# Altium schematic sheet Power_Circuit.SchDoc
size A; SheetNumber: 1; SheetTotal: 5
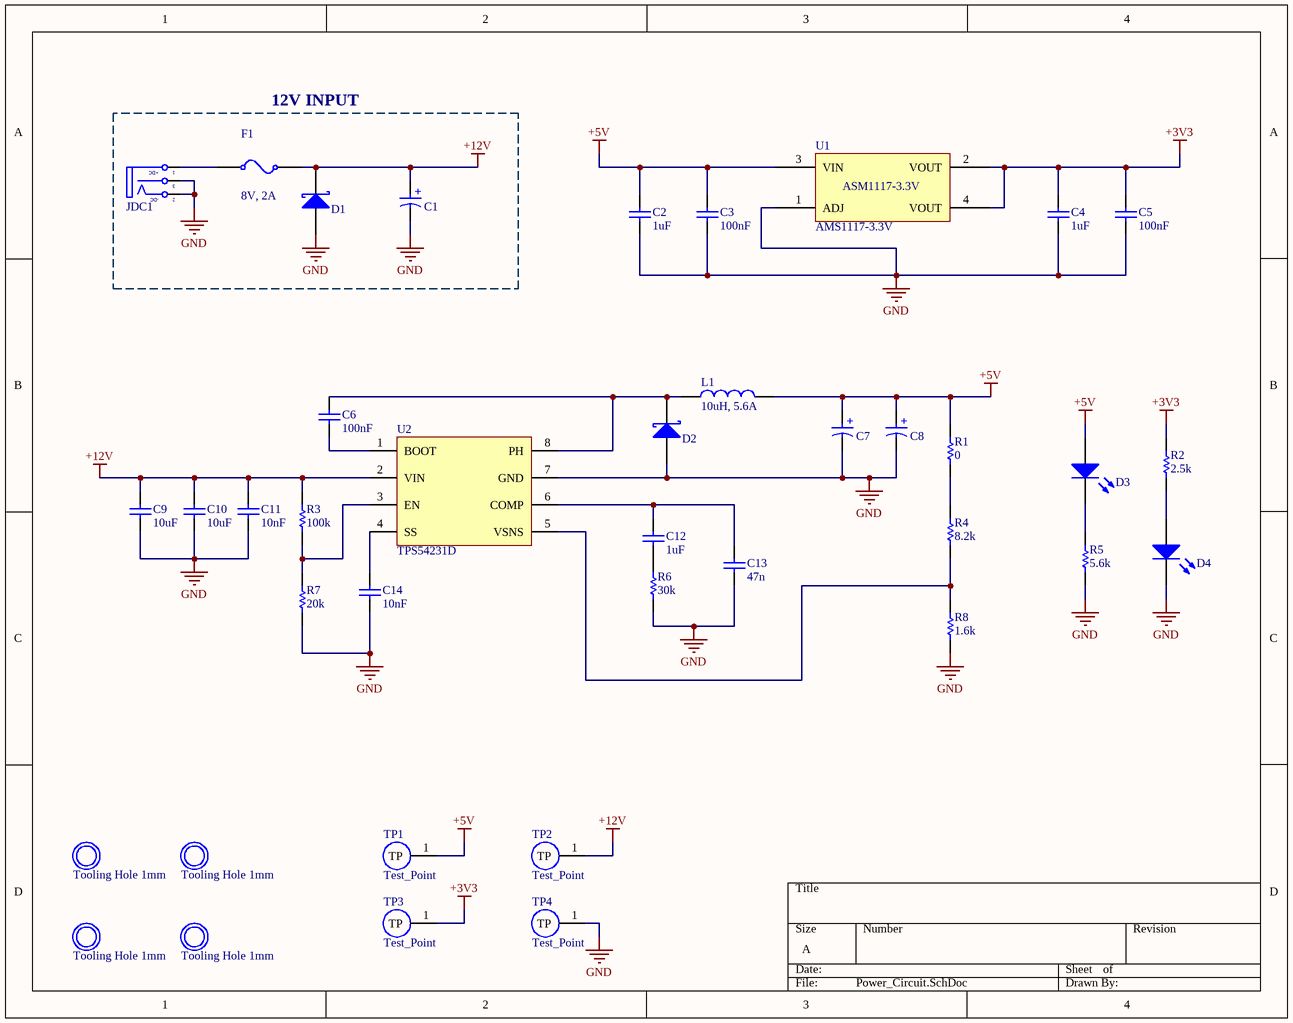
[diagram p0: Power_Circuit.SchDoc]

## Parts
C1  47uF  [WCAP-ASLI_D4H5.5]  (value not drawn)
C2  1uF  [CAP_0603]
C3  100nF  [CAP_0603]
C4  1uF  [CAP_0603]
C5  100nF  [CAP_0603]
C6  100nF  [CAP_0603]
C7  47uF  [WCAP-ASLI_D5H5.5]  (value not drawn)
C8  47uF  [WCAP-ASLI_D5H5.5]  (value not drawn)
C9  10uF  [CAP_0603]
C10  10uF  [CAP_0603]
C11  10nF  [CAP_0603]
C12  1uF  [CAP_0603]
C13  47n  [CAP_0603]
C14  10nF  [CAP_0603]
D1  D Schottky  [SS34]  (value not drawn)
D2  D Schottky  [SS34]  (value not drawn)
D3  LED SMD  [LED_0805_Blue]  (value not drawn)
D4  LED SMD  [LED_0805_Blue]  (value not drawn)
F1  8V, 2A  [Fuse_SMD_1812]
H1  Tooling Hole 1mm  [2mm]
H2  Tooling Hole 1mm  [2mm]
H3  Tooling Hole 1mm  [2mm]
H4  Tooling Hole 1mm  [2mm]
JDC1  Jack DC  [DC-IN]  (value not drawn)
L1  10uH, 5.6A  [WE-PD2A_5848]
R1  0  [resistor_0603]
R2  2.5k  [resistor_0603]
R3  100k  [resistor_0603]
R4  8.2k  [resistor_0603]
R5  5.6k  [resistor_0603]
R6  30k  [resistor_0603]
R7  20k  [resistor_0603]
R8  1.6k  [resistor_0603]
TP1  Test_Point  [TP_2MM]
TP2  Test_Point  [TP_2MM]
TP3  Test_Point  [TP_2MM]
TP4  Test_Point  [TP_2MM]
U1  AMS1117-3.3V  [AMS1117-3.3V SOT223]
U2  TPS54231D  [SOIC8]

## Blocks framed on the sheet
12V INPUT: C1 D1 F1 JDC1

## Nets
+3V3: C4.2 C5.2 R2.2 TP3.1(TP) U1.2(VOUT) U1.4(VOUT)
+5V: C2.2 C3.2 C7.1(P) C8.1(P) D3.1(A) L1.2 R1.2 TP1.1(TP) U1.3(VIN)
+12V: C1.1(P) C9.2 C10.2 C11.2 D1.2(K) F1.1 R3.2 TP2.1(TP) U2.2(VIN)
GND: C1.2(N) C2.1 C3.1 C4.1 C5.1 C7.2(N) C8.2(N) C9.1 C10.1 C11.1 C13.1 C14.1 D1.1(A) D2.1(A) D4.2(K) JDC1.2(TN) JDC1.3(S) R5.1 R6.1 R7.1 R8.1 TP4.1(TP) U1.1(ADJ) U2.7(GND)
NetC6_1: C6.1 U2.1(BOOT)
NetC6_2: C6.2 D2.2(K) L1.1 U2.8(PH)
NetC12_1: C12.1 C13.2 U2.6(COMP)
NetC12_2: C12.2 R6.2
NetC14_2: C14.2 U2.4(SS)
NetD3_2: D3.2(K) R5.2
NetD4_1: D4.1(A) R2.1
NetF1_0: F1.0 JDC1.1(T)
NetR1_1: R1.1 R4.2
NetR3_1: R3.1 R7.2 U2.3(EN)
NetR4_1: R4.1 R8.2 U2.5(VSNS)

## Notes on the sheet
- (in symbol 865080340003) +
- (in symbol 865080342006) +
- (in symbol AMS1117-3.3V) ASM1117-3.3V
- (in symbol Jack DC) +DC; -DC

## Library data of the parts
C1 = 865080340003: V-Chip, D4 x H5.5mm, 22uF, 16V; Capacitance Tolerance: +/-20%; Dissipation Factor: 16%; Endurance: 2000h; Leakage Current: 3.52uA; Ripple Current: 90mA; Supply 1 Name: Mouser; Supply 1 SN: 710-865080340003; Supply 2 Name: thegioiic; Category: Aluminum Electrolytic Capacitors; ComponentLink2Description: Datasheet Link; ComponentLink2URL: https://www.we-online.com/redexpert/spec/865080340003?ad; Mount: Surface Mount; Operating Temperature Max: 105°C; Operating Temperature Min: -55°C; Packaging: Tape and Reel; Height: 5.5mm; Diameter: 4mm; Capacitance: 22uF; Rated Voltage (DC): 16V; Supply 1 URL: https://www.mouser.com/ProductDetail/Wurth-Elektronik/865080340003?qs=0KOYDY2FL2%252BowmC4S50IuQ%3D%3D; Supply 2 URL: https://www.thegioiic.com/tu-nhom-smd-22uf-16v-4x5-4mm
C2 C4 C12 = 01060310510: CAP, size 0603, 1uF; Supply 1 SN: 885012206126; Supply 1 name: Wurth Elektronik; Supply 2 name: Thegioiic; Capacitance Tolerance: +/-10%; ComponentLink1Description: Manufacturer; ComponentLink1URL: http://www.we-online.de; ComponentLink2Description: Datasheet; ComponentLink2URL: https://www.we-online.com/components/products/datasheet/885012206126.pdf; Operating Temperature: -55 to +125degC; Packaging: Tape and Reel; Supply 1 URL: https://www.we-online.com/en/components/products/WCAP-CSGP-50VDC?sq=885012206126#885012206126; Supply 2 SN: *; Supply 2 URL: https://www.thegioiic.com/tu-gom-0603-1uf-50v; Dissipation Factor: *; Height: *; Mounting Technology: SMT; Size: 0603; Capacitance: 1uF; Technical Reference: *
C3 C5 C6 = 01060310410: CAP, size 0603, 100nF; Supply 1 SN: 885012206095; Supply 1 name: Wurth Elektronik; Supply 2 name: Thegioiic; Capacitance Tolerance: +/-10%; ComponentLink1Description: Manufacturer; ComponentLink1URL: http://www.we-online.de; ComponentLink2Description: Datasheet; ComponentLink2URL: https://www.we-online.com/catalog/datasheet/885012206095.pdf; Operating Temperature: -55 to +125degC; Packaging: Tape and Reel; Supply 1 URL: https://www.we-online.com/en/components/products/WCAP-CSGP-50VDC?sq=885012206095R#885012206095R; Supply 2 SN: *; Supply 2 URL: https://www.thegioiic.com/tu-gom-0603-100nf-0-1uf-50v; Dissipation Factor: *; Height: *; Mounting Technology: SMT; Size: 0603; Capacitance: 100nF; Technical Reference: *
C7 C8 = 865080342006: V-Chip, D5 x H5.5mm, 47uF, 16V; Capacitance Tolerance: +/-20%; Dissipation Factor: 16%; Endurance: 2000h; Leakage Current: 7.52uA; Ripple Current: 195mA; Supply 1 Name: Mouser; Supply 1 SN: 710-865080262015; Supply 2 Name: thegioiic; Category: Aluminum Electrolytic Capacitors; ComponentLink2Description: Datasheet Link; ComponentLink2URL: https://www.we-online.com/redexpert/spec/865080342006?ad; Mount: Surface Mount; Operating Temperature Max: 105°C; Operating Temperature Min: -55°C; Packaging: Tape and Reel; Height: 5.5mm; Diameter: 5mm; Capacitance: 47uF; Rated Voltage (DC): 16V; Supply 1 URL: https://www.mouser.com/ProductDetail/Wurth-Elektronik/865080262015?qs=0KOYDY2FL2%2Ffe5w2MssUoQ%3D%3D; Supply 2 URL: https://www.thegioiic.com/tu-nhom-smd-47uf-16v-5x5-4mm
C9 C10 = 01060310010: CAP, size 0603,10uF; Supply 2 name: Thegioiic; Capacitance Tolerance: +/-10%; ComponentLink1Description: Manufacturer; ComponentLink1URL: *; ComponentLink2Description: Datasheet; ComponentLink2URL: *; Operating Temperature: -55 to +125degC; Packaging: Tape and Reel; Supply 1 SN: *; Supply 1 name: *; Supply 1 URL: *; Supply 2 SN: *; Supply 2 URL: https://www.thegioiic.com/tu-gom-0603-10uf-16v; Dissipation Factor: *; Height: *; Mounting Technology: SMT; Size: 0603; Capacitance: 10uF; Technical Reference: *
C11 C14 = 01060310310: CAP, size 0603, 10nF; Supply 1 SN: 885012206089; Supply 1 name: Wurth Elektronik; Supply 2 name: Thegioiic; Capacitance Tolerance: +/-10%; ComponentLink1Description: Manufacturer; ComponentLink1URL: http://www.we-online.de; ComponentLink2Description: Datasheet; ComponentLink2URL: https://www.we-online.com/catalog/datasheet/885012206089.pdf; Operating Temperature: -55 to +125degC; Packaging: Tape and Reel; Supply 1 URL: https://www.we-online.com/en/components/products/WCAP-CSGP-50VDC?sq=885012206089#885012206089; Supply 2 SN: *; Supply 2 URL: https://www.thegioiic.com/tu-gom-0603-10nf-50v; Dissipation Factor: *; Height: *; Mounting Technology: SMT; Size: 0603; Capacitance: 10nF; Technical Reference: *
C13 = 01060347310: CAP, size 0603, 47nF; Supply 1 SN: 885012206093; Supply 1 name: Wurth Elektronik; Supply 2 name: Thegioiic; Capacitance Tolerance: +/-10%; ComponentLink1Description: Manufacturer; ComponentLink1URL: http://www.we-online.de; ComponentLink2Description: Datasheet; ComponentLink2URL: https://www.we-online.com/catalog/datasheet/885012206093.pdf; Operating Temperature: -55 to +125degC; Packaging: Tape and Reel; Supply 1 URL: https://www.we-online.com/en/components/products/WCAP-CSGP-50VDC?sq=885012206093#885012206093; Supply 2 SN: *; Supply 2 URL: https://www.thegioiic.com/tu-gom-0603-47nf-50v; Dissipation Factor: *; Height: *; Mounting Technology: SMT; Size: 0603; Capacitance: 47nF; Technical Reference: *
D1 D2 = D Schottky: Schottky Diode; Published: 8-Jun-2000; LatestRevisionDate: 17-Jul-2002; LatestRevisionNote: Re-released for DXP Platform.; PackageReference: SMB; Publisher: Altium Limited; PackageDescription: DO-214-AA/SMB; 2 C-Bend Leads; Body 5.3 x 3.6 mm, inc. leads (LxW); Code_JEDEC: DO-214-AA
D3 D4 = LED SMD: LED
F1 = 061812200008: Resettable Fuse, Size 1812, 8V, 2A; Manufacturer: Littelfuse; Threshold Current: 100A; Trip Current: 4A; Supply 1 Name: Mouser; Supply 1 SN: 650-MINISMDC200F-2; Supply 2 Name: Digikey; Supply 2 SN: MINISMDC200F-2TR-ND; Supply 3 Name: Thegioiic; Threshold Voltage: 8V; Hold Current: 2A; Size: 1812; Mounting Technology: SMT/SMD; ComponentLink1Description: Datasheet link; ComponentLink1URL: https://www.littelfuse.com/~/media/electronics/product_specifications/resettable_ptcs/littelfuse_ptc_minismdc300f_2_product_specification.pdf.pdf; ComponentLink2Description: Supply 1 URL; ComponentLink2URL: https://www.mouser.vn/ProductDetail/Littelfuse/MINISMDC200F-2?qs=F6FIpiMdEVbPu4q%2F42CC1w%3D%3D; ComponentLink3Description: Supply 2 URL; ComponentLink3URL: https://www.digikey.com/en/products/detail/littelfuse-inc/MINISMDC200F-2/1045898?s=N4IgTCBcDaIAQFkCSA5JBlBARAwmADPgGIC0EAugL5A; ComponentLink4Description: Supply 3 URL; ComponentLink4URL: https://www.thegioiic.com/cau-chi-tu-phuc-hoi-1812-8v-2a; Supply 3 SN: N/A
H1-H4 = Tooling Hole 2mm
JDC1 = Jack DC: Jack DC input; Value: Jac DC
L1 = 78477410: WE-PD2A SMT Power Inductor, size 5848, 10uH, 2.2A; Manufacturer: Wurth Elektronik; DC Resistance max.: 0.1Ohm; Saturation Current: 2.5A; Self Resonant Frequency: 26MHz; DC Resistance typ.: 0.078Ohm; Rated Voltage: 80VDC; Supply 1 Name: Digi-Key; Supply 1 SN: 732-6830-2-ND; Supply 2 Name: Mouser; Supply 2 SN: 710-78477410; Supply 3 Name: thegioiic; ComponentLink1Description: Manufacturer; ComponentLink1URL: http://www.we-online.de; ComponentLink2Description: Datasheet; ComponentLink2URL: https://www.we-online.com/catalog/datasheet/78477410.pdf; Manufacturer Part Number: 78477410; Published Date: May 2020; Rated Current: 2.2A; Inductance: 10uH; Operating Temperature: -40 to +125degC; Mounting Technology: SMT; Packaging: Tape and Reel; Size: 5848; Supply 1 URL: https://www.digikey.com/en/products/detail/w%C3%BCrth-elektronik/78477410/5168779?s=N4IgTCBcDaIOwA4Asc5IIwAYQF0C%2BQA; Supply 2 URL: https://www.mouser.vn/ProductDetail/Wurth-Elektronik/78477410?qs=sBf%2Fb4nBSldlX6CYaJExDg%3D%3D; Supply 3 URL: https://www.thegioiic.com/cuon-cam-dan-smd-cd53-5852-100-10uh-1-8a
R1 = 0006030001: RES, 0 Ohm, size 0603, 1%; Resistance tolerance: +/-5%; Rated Power: 1/4 W; Resistance: 2.5K; Size: 0603; Mounting Technology: SMT; Datasheet: *; ComponentLink1Description: Datasheet link; ComponentLink1URL: *; Supply 1 Name: *; Supply 1 SN: *; Supply 1 URL: *; Supply 2 Name: *; Supply 2 SN: *; Supply 2 URL: *; Supply 3 Name: *; Supply 3 SN: *; Supply 3 URL: *; Manufacture  Name: *; Manufacture  SN: *
R2 = 0006032525: RES, 2.5K Ohm, size 0603, 5%; Resistance tolerance: +/-5%; Rated Power: 1/4 W; Size: 0603; Mounting Technology: SMT; Datasheet: *; Resistance: 2.5K; ComponentLink1Description: Datasheet link; ComponentLink1URL: *; Supply 1 Name: *; Supply 1 SN: *; Supply 1 URL: *; Supply 2 Name: *; Supply 2 SN: *; Supply 2 URL: *; Supply 3 Name: *; Supply 3 SN: *; Supply 3 URL: *; Manufacture  Name: *; Manufacture  SN: *
R3 = 0006031041: RES, 100k Ohm, size 0603, 1%; Resistance Tolerant: +/-1%; Rated Power: 1/4W; Supply 1 Name: Mouser; Supply 1 SN: 603-SR0603FR-7T100KL; Supply 2 Name: Digikey; Supply 2 SN: YAG5821TR-ND YAG5821CT-ND YAG5821DKR-ND; Resistance: 100k; Size: 0603; Mounting Technology: SMT; ComponentLink1Description: Datasheet link; ComponentLink1URL: https://www.yageo.com/upload/media/product/productsearch/datasheet/rchip/PYu-SR_20105_RoHS_L_10.pdf; ComponentLink2Description: Supply 1 URL; ComponentLink2URL: https://www.mouser.vn/ProductDetail/YAGEO/SR0603FR-7T100KL?qs=sGAEpiMZZMvdGkrng054tz1y1XEHv7sNa%252BA%2F4WiDMf7aGw4zRBb%2FFQ%3D%3D; ComponentLink3Description: Supply 2 URL; ComponentLink3URL: https://www.digikey.com/en/products/detail/yageo/SR0603FR-7T100KL/9373095
R4 = 0006038251: RES, 8.2 kOhms, size 0603, 1%; Resistance tolerance: +/-1%; Rated Power: 1/4 W; Supply 1 Name: Mouser; Supply 1 SN: 660-HV731JTTD8204F; Supply 2 Name: Digi-Key; Supply 2 SN: 13-RC0603FR-078M2LTR-ND; Size: 0603; Mounting Technology: SMT; Resistance: 8.2K; ComponentLink1Description: Datasheet link; ComponentLink1URL: *; Supply 1 URL: https://www.mouser.vn/ProductDetail/KOA-Speer/HV731JTTD8204F?qs=ZqVPfSd1khqN0teaqWW7DA%3D%3D; Supply 2 URL: https://www.digikey.com/en/products/detail/yageo/RC0603FR-078M2L/5918418; Supply 3 Name: *; Supply 3 SN: *
R5 = 0006035621: RES, 5.6k Ohm, size 0603, 1%; Resistance Tolerant: +/-1%; Rated Power: 1/4W; Supply 1 Name: Mouser; Supply 1 SN: 667-ERJ-UP3F5601V; Supply 2 Name: Digikey; Supply 2 SN: 10-ERJ-UP3F5601VTR-ND 10-ERJ-UP3F5601VCT-ND 10-ERJ-UP3F5601VDKR-ND; Resistance: 5.6k; Size: 0603; Mounting Technology: SMT; ComponentLink1Description: Datasheet link; ComponentLink1URL: https://api.pim.na.industrial.panasonic.com/file_stream/main/fileversion/4484; ComponentLink2Description: Supply 1 URL; ComponentLink2URL: https://www.mouser.vn/ProductDetail/Panasonic/ERJ-UP3F5601V?qs=sGAEpiMZZMvdGkrng054twq3eZrCFN89ezYxgAsnxBTZYD17cS%252B65A%3D%3D; ComponentLink3Description: Supply 2 URL; ComponentLink3URL: https://www.digikey.com/en/products/detail/panasonic-electronic-components/ERJ-UP3F5601V/12092890
R6 = 0006033205: RES, 30k Ohm, size 0603, 1%; Resistance tolerance: +/-1%; Rated Power: 1/4 W; Size: 0603; Mounting Technology: SMT; Datasheet: *; Resistance: 30k; ComponentLink1Description: Datasheet link; ComponentLink1URL: *; Supply 1 Name: *; Supply 1 SN: *; Supply 1 URL: *; Supply 2 Name: *; Supply 2 SN: *; Supply 2 URL: *; Supply 3 Name: *; Supply 3 SN: *; Supply 3 URL: *; Manufacture  Name: *; Manufacture  SN: *
R7 = 0006032031: RES, 20 kOhms, size 0603, 1%; Resistance tolerance: +/-1%; Rated Power: 1/4 W; Supply 1 Name: Mouser; Supply 1 SN: 667-ERJ-S03F2002V; Supply 2 Name: Digi-Key; Supply 2 SN: 13-RC0603FR-1320KLTR-ND; Size: 0603; Mounting Technology: SMT; Resistance: 20 k; ComponentLink1Description: Datasheet link; ComponentLink1URL: *; Supply 1 URL: https://www.mouser.vn/ProductDetail/Panasonic/ERJ-S03F2002V?qs=Zyl8A9hlmJopfTdqNIDujw%3D%3D; Supply 2 URL: https://www.digikey.com/en/products/detail/yageo/RC0603FR-1320KL/13694225; Supply 3 Name: *; Supply 3 SN: *
R8 = 0006031521: RES, 1.5 kOhms, size 0603, 1%; Resistance tolerance: +/-1%; Rated Power: 1/4 W; Resistance: 1.5 k; Supply 1 Name: Mouser; Supply 1 SN: 755-SFR03EZPF1501; Supply 2 Name: Digi-Key; Supply 2 SN: 13-RC0603FR-071R5LTR-ND; Size: 0603; Mounting Technology: SMT; ComponentLink1Description: Datasheet link; ComponentLink1URL: *; Supply 1 URL: https://www.mouser.vn/ProductDetail/ROHM-Semiconductor/SFR03EZPF1501?qs=byeeYqUIh0NryWvnzlukLQ%3D%3D; Supply 2 URL: https://www.digikey.com/en/products/detail/yageo/RC0603FR-071R5L/5918292; Supply 3 Name: *; Supply 3 SN: *
TP1-TP4 = Test_Point: Test point, 2mm radius
U1 = AMS1117-3.3V: AMS1117-3.3V, OUT 3.3V 1A.; Manufacturer: AMS; Pad Count: 4; Current Output Maximum: 1A; Voltage Input Maximum: 15V; Manufacturer Part Number: *; Part Number: *; Current Input Maximum: *; Supplier 1 Link: *; Supplier 1 Name: *; Supplier 2 Link: *; Supplier 2 Name: *; Supplier 2 Part Number: *; Supplier 3 Link: https://www.thegioiic.com/ams1117-3-3v-ic-on-ap-3-3v-1a-sot-223; Supplier 3 Name: ThegioiIC; Supplier 3 Part Number: *; Voltage Output: 3.3V; Mounting Technology: SMD; Supplier 1 Part Number: *; Datasheet: http://www.advanced-monolithic.com/pdf/ds1117.pdf
U2 = TPS54231: Buck Switching Regulator IC Positive Adjustable 0.8V 1 Output 2A 8-SOIC (0.154", 3.90mm Width); Mfr: Texas Instruments; Function: Step-Down; Number of Outputs: 1; Voltage - Input (Min): 3.5V; Voltage - Input (Max): 28V; Voltage - Output (Max): 25V; Frequency - Switching: 570kHz; Category: Integrated Circuits (ICs); Output Configuration: Positive; Topology: Buck; Output Type: Adjustable; Voltage - Output (Min/Fixed): 0.8V; Current - Output: 2A; Operating Temperature: -40°C ~ 150°C (TJ); Mounting Type: Surface Mount; ComponentLink1Description: Thegioiic; ComponentLink1URL: https://www.thegioiic.com/tps54231dr-ic-dieu-chinh-giam-ap-2a-8-soic; ComponentLink2Description: Datasheet; ComponentLink2URL: https://www.ti.com/lit/ds/symlink/tps54231.pdf